# EAGLE design ESP-01_daughter_board (EAGLE 8.6.3)
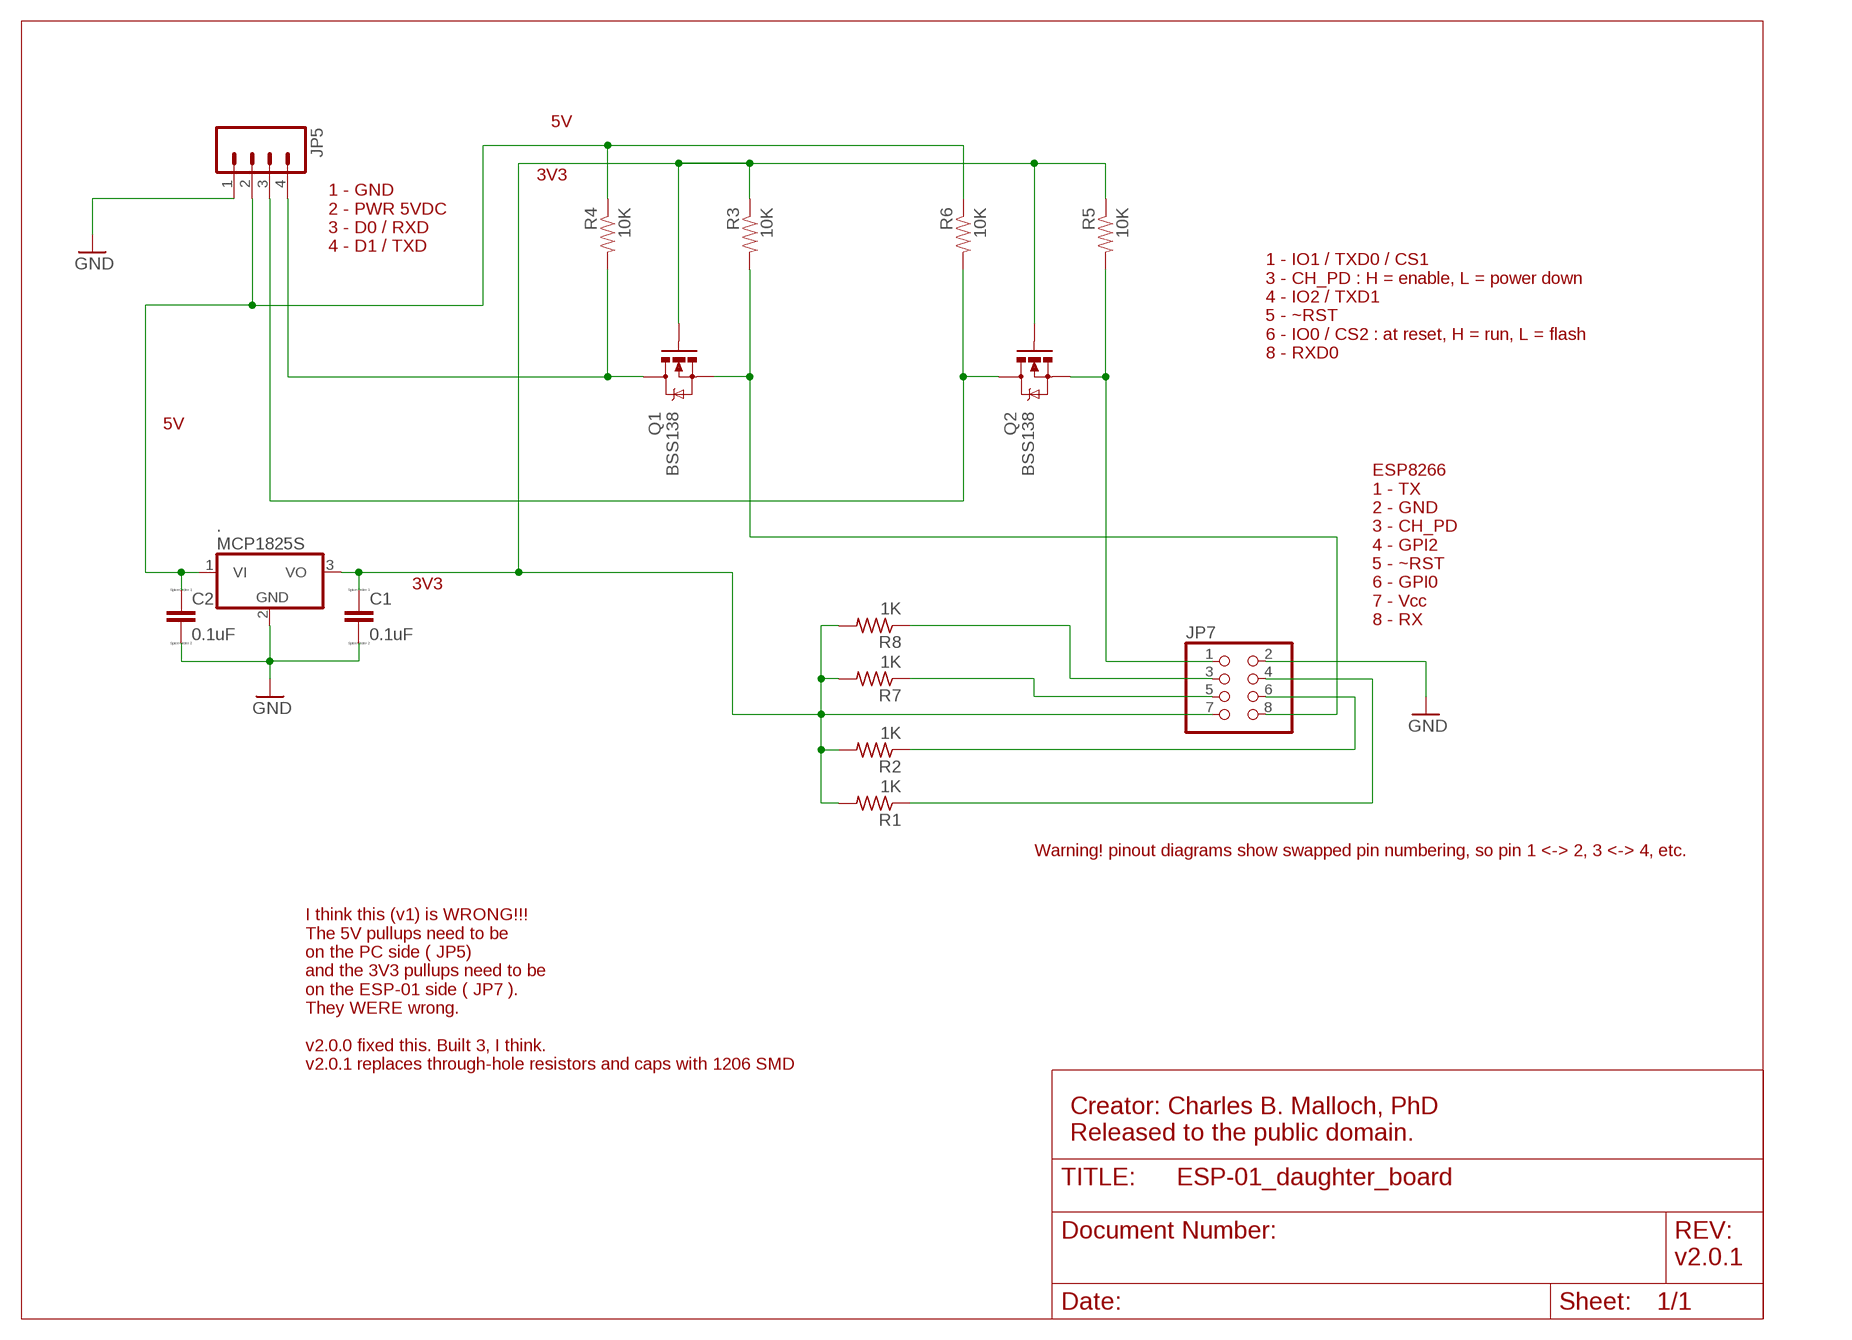
[diagram p0: schematic, sheet 1]

## Parts
.  MCP1825S  MCP1703DB  [SOT223]
C1  0.1uF  CC1206  [C1206]
C2  0.1uF  CC1206  [C1206]
JP5  M04LOCK_LONGPADS  [1X04_LOCK_LONGPADS]
JP7  PINHD-2X4  [2X04]
Q1  BSS138  BSS138TRANS-00830  [SOT23-3]
Q2  BSS138  BSS138TRANS-00830  [SOT23-3]
R1  1K  R-US_M1206  [M1206]
R2  1K  R-US_M1206  [M1206]
R3  10K  RESISTOR1206  [1206]
R4  10K  RESISTOR1206  [1206]
R5  10K  RESISTOR1206  [1206]
R6  10K  RESISTOR1206  [1206]
R7  1K  R-US_M1206  [M1206]
R8  1K  R-US_M1206  [M1206]

## Nets
3V3 [POWER]: ..3(VO) C1.1 JP7.7 Q1.1(G) Q2.1(G) R1.2 R2.2 R3.1 R5.1 R7.2 R8.2
5V [POWER]: ..1(VI) C2.1 JP5.2 R4.1 R6.1
E-RX: JP7.8 Q1.2(S) R3.2
E-TX: JP7.1 Q2.2(S) R5.2
GND [POWER]: ..2(GND) C1.2 C2.2 JP5.1 JP7.2
N$13: JP7.3 R8.1
N$21: JP7.5 R7.1
N$22: JP7.6 R2.1
N$24: JP7.4 R1.1
RX: JP5.3 Q2.3(D) R6.2
TX: JP5.4 Q1.3(D) R4.2

## Notes on the sheet
- 5V
- 3V3
- 1 - GND
   2 - PWR 5VDC
   3 - D0 / RXD
   4 - D1 / TXD
- 1 - IO1 / TXD0 / CS1
  3 - CH_PD : H = enable, L = power down
  4 - IO2 / TXD1
  5 - ~RST
  6 - IO0 / CS2 : at reset, H = run, L = flash
  8 - RXD0
- 5V
- 3V3
- ESP8266
  1 - TX
  2 - GND
  3 - CH_PD
  4 - GPI2
  5 - ~RST
  6 - GPI0
  7 - Vcc
  8 - RX
- Warning! pinout diagrams show swapped pin numbering, so pin 1 <-> 2, 3 <-> 4, etc.
- I think this (v1) is WRONG!!!
  The 5V pullups need to be 
  on the PC side ( JP5) 
  and the 3V3 pullups need to be 
  on the ESP-01 side ( JP7 ).
  They WERE wrong.
  
  v2.0.0 fixed this. Built 3, I think.
  v2.0.1 replaces through-hole resistors and caps with 1206 SMD
- Creator: Charles B. Malloch, PhD
  Released to the public domain.
- v2.0.1

## Library data of the parts
. = linear:MCP1703: 250 mA, 16V, Low Quiescent Current LDO Regulator Source: http://ww1.microchip.com/downloads/en/DeviceDoc/22049b.pdf
C1 C2 = eagle-ltspice:C: CAPACITOR, European symbol; SPICEMODEL: NONE; SPICEPREFIX: C
JP5 = SparkFun-Connectors:M04: Header 4 Standard 4-pin 0.1" header. Use with straight break away headers (SKU : PRT-00116), right angle break away headers (PRT-00553), swiss pins (PRT-00743), machine pins (PRT-00117), and female headers (PRT-00115). Molex polarized connector foot print use with SKU : PRT-08231 with associated crimp pins and housings. 1MM SMD Version SKU: PRT-10208
JP7 = pinhead:PINHD-2X4: PIN HEADER
Q1 Q2 = SparkFun-DiscreteSemi:BSS138: NMOSFET, Enh Mode 50V/6-ohm 200mA (SOT-23) TRANS-00830; PROD_ID: TRANS-00830
R1 R2 R7 R8 = rcl:R-US_: RESISTOR, American symbol
R3-R6 = SparkFun-Passives:RESISTOR: Resistor Basic schematic elements and footprints for 0603, 1206, and PTH resistors.

## Net classes
0 default: width 0.406 mm, clearance 0.203 mm
1 POWER: width 0.61 mm, clearance 0.305 mm

## Board
Arduino specialized to drive 3-color LED / LED strip
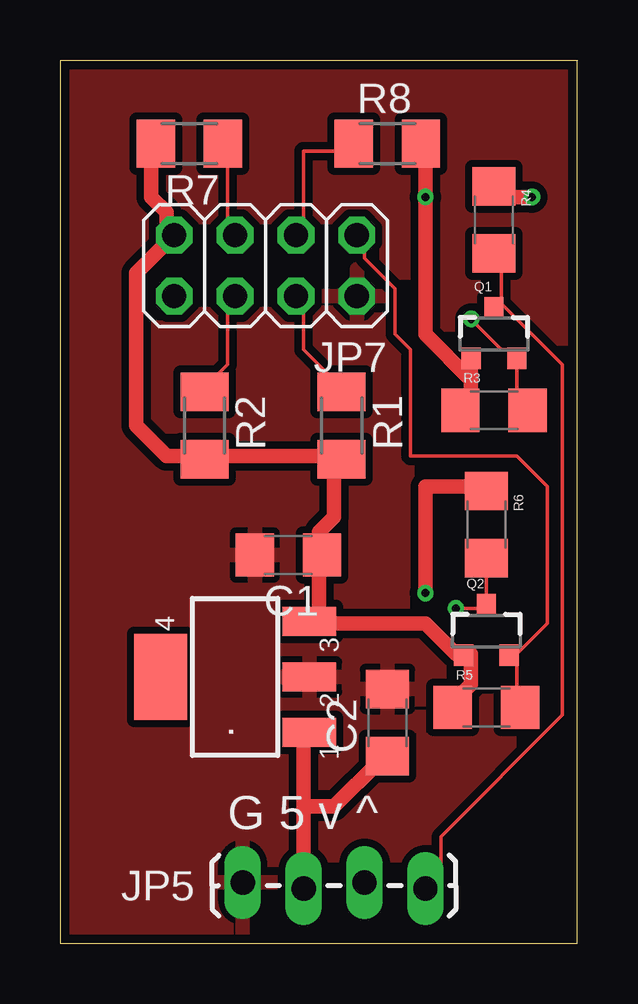
[diagram p1: board, top side]
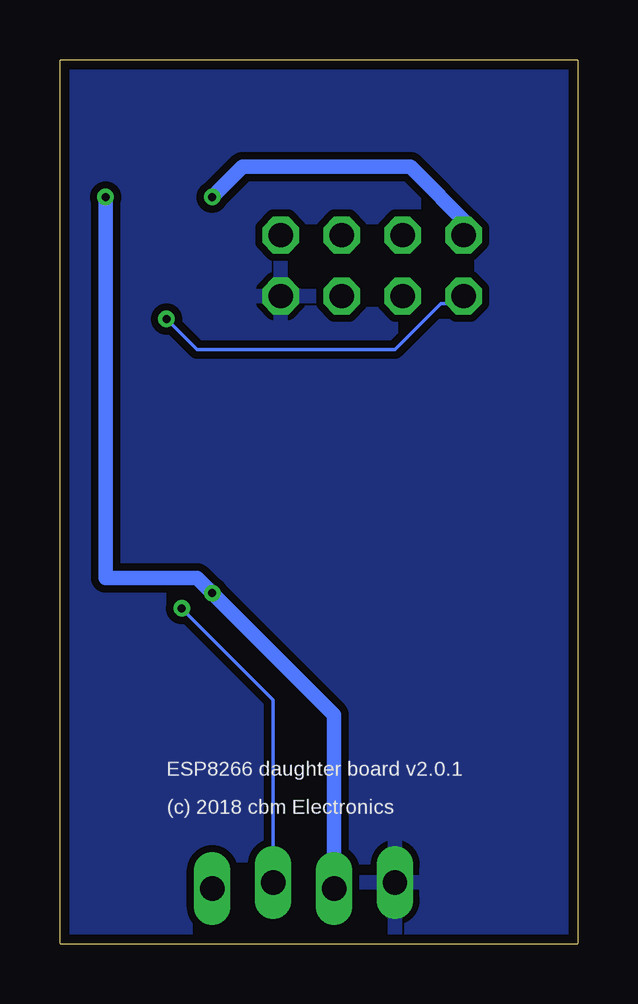
[diagram p2: board, bottom side, seen from below]

Size 21.59 x 36.84 mm. Coordinates in mm from the lower left corner, seen from the top.
Outline: 21.58,0.01 21.58,36.83
Outline: 0,0.01 0,36.84 21.59,36.84
Outline: 21.58,0 0,0
Copper layers (1*16): Top 0.0356mm / dielectric 1.5011mm / Bottom 0.0356mm
Design rules "LaenPCBOrder": minimum track width 6mil, minimum drill 13mil, track to track 6mil, track to pad 6mil, pad to pad 6mil, via to via 6mil, smd to smd 6mil, copper to edge 15mil, drill to drill 6mil, minimum pad ring 7mil, minimum via ring 7mil, stop-mask expansion 4mil, vias tented up to drill 0mil, thermal gap 10mil

### Footprints (pad centres in the part's own frame; a part is rotated, then mirrored left to right if it is on the bottom)
SOT223 = smd 1.219 x 2.235: 1 -2.311,-3.099; 2 0,-3.099; 3 2.311,-3.099 | smd 3.6 x 2.2: 4 0,3.099
C1206 = smd 1.6 x 1.8: 1 -1.4,0; 2 1.4,0
1X04_LOCK_LONGPADS = drill 1.016 long: 1 0,0; 2 2.54,-0.254; 3 5.08,0; 4 7.62,-0.254
2X04 = drill 1.016 octagon: 1 -3.81,-1.27; 2 -3.81,1.27; 3 -1.27,-1.27; 4 -1.27,1.27; 5 1.27,-1.27; 6 1.27,1.27; 7 3.81,-1.27; 8 3.81,1.27
SOT23-3 = smd 0.8 x 0.9: 1 -0.95,-1; 2 0.95,-1; 3 0,1.1
M1206 = smd 1.6 x 2: 1 -1.4,0; 2 1.4,0
1206 = smd 1.6 x 1.8: 1 -1.4,0; 2 1.4,0

### Placement (x,y rotation side)
.  7.3,11.12 90 top
C1  9.53,16.2 180 top
C2  13.65,9.22 90 top
JP5  7.62,2.55 0 top
JP7  8.57,28.27 180 top
Q1  18.1,25.41 0 top
Q2  17.78,13.03 0 top
R1  11.75,21.6 270 top
R2  6.03,21.6 270 top
R3  18.1,22.24 0 top
R4  18.1,30.17 270 top
R5  17.78,9.85 0 top
R6  17.78,17.47 270 top
R7  5.4,33.35 180 top
R8  13.65,33.35 0 top

### Tracks (layer width: path | path; a pad name or v marks a point on that pad's centre or on a via)
3V3  (via drill 0.33)
  Top 0.61: 17.14,23.51 17.14,22.24 R3.1 | 17.14,23.51 17.14,24.14 Q1.1 | 17.14,23.51 15.24,25.41 v15.24,31.12 15.24,33.03 R8.2 | R7.2 3.81,33.03 3.81,31.12 4.45,30.49 4.45,29.86 JP7.7 3.17,27.95 3.17,21.6 4.45,20.33 5.71,20.33 R2.2 6.35,20.33 11.43,20.33 R1.2 11.43,19.7 11.43,17.79 10.79,17.16 10.79,16.52 C1.1 10.79,15.88 10.79,13.98 ..3 10.79,13.35 15.24,13.35 16.51,12.07 Q2.1 17.14,12.07 17.14,10.8 16.51,10.17 R5.1
  Bottom 0.61: v15.24,31.12 13.97,32.39 6.99,32.39 4.45,29.86 JP7.7
5V  (via drill 0.33)
  Top 0.61: 10.16,5.72 11.43,5.72 13.34,7.63 C2.1 | 10.16,5.72 10.16,8.27 ..1 | v15.24,14.62 15.24,19.06 17.78,19.06 R6.1 | v19.68,31.12 18.41,31.12 R4.1 | JP5.2 10.16,5.72
  Bottom 0.61: JP5.2 10.16,9.54 v15.24,14.62 15.88,15.25 19.68,15.25 v19.68,31.12
E-RX  (via drill 0.33)
  Top 0.152: R3.2 19.05,22.24 19.05,24.14 Q1.2 19.05,24.78 18.41,24.78 v17.14,26.05
  Bottom 0.152: v17.14,26.05 15.88,24.78 7.62,24.78 5.71,26.68 5.08,26.68 JP7.8
E-TX
  Top 0.152: 19.05,12.07 19.05,10.17 R5.2 | 19.05,12.07 20.32,13.35 20.32,19.06 19.05,20.33 14.61,20.33 14.61,24.78 13.97,25.41 13.97,27.32 12.7,28.59 12.7,29.22 JP7.1 | 19.05,12.07 Q2.2
GND
  pour Top: 0,36.84 0,0.01 21.59,0.01 21.59,36.84
  pour Bottom: 0,36.84 21.59,36.84 21.59,0.01 0,0.01
N$13
  Top 0.152: R8.1 12.06,33.03 10.16,33.03 10.16,29.86 JP7.3
N$21
  Top 0.152: R7.1 6.99,33.03 6.99,29.86 JP7.5
N$22
  Top 0.152: R2.1 6.35,23.51 6.99,24.14 6.99,26.68 JP7.6
N$24
  Top 0.152: R1.1 11.43,23.51 10.16,24.78 10.16,26.68 JP7.4
RX  (via drill 0.33)
  Top 0.152: R6.2 Q2.3 17.78,13.98 v16.51,13.98
  Bottom 0.152: v16.51,13.98 12.7,10.17 JP5.3
TX
  Top 0.152: 18.41,26.68 18.41,28.59 R4.2 | 18.41,26.68 20.95,24.14 20.95,9.54 15.88,4.46 15.88,3.18 15.24,2.55 JP5.4 | 18.41,26.68 Q1.3

### Text on the board
tNames: G 5 v ^
bNames: ESP8266 daughter board v2.0.1 | (c) 2018 cbm Electronics